# Altium schematic sheet WT2_Sensors.SchDoc
size A4
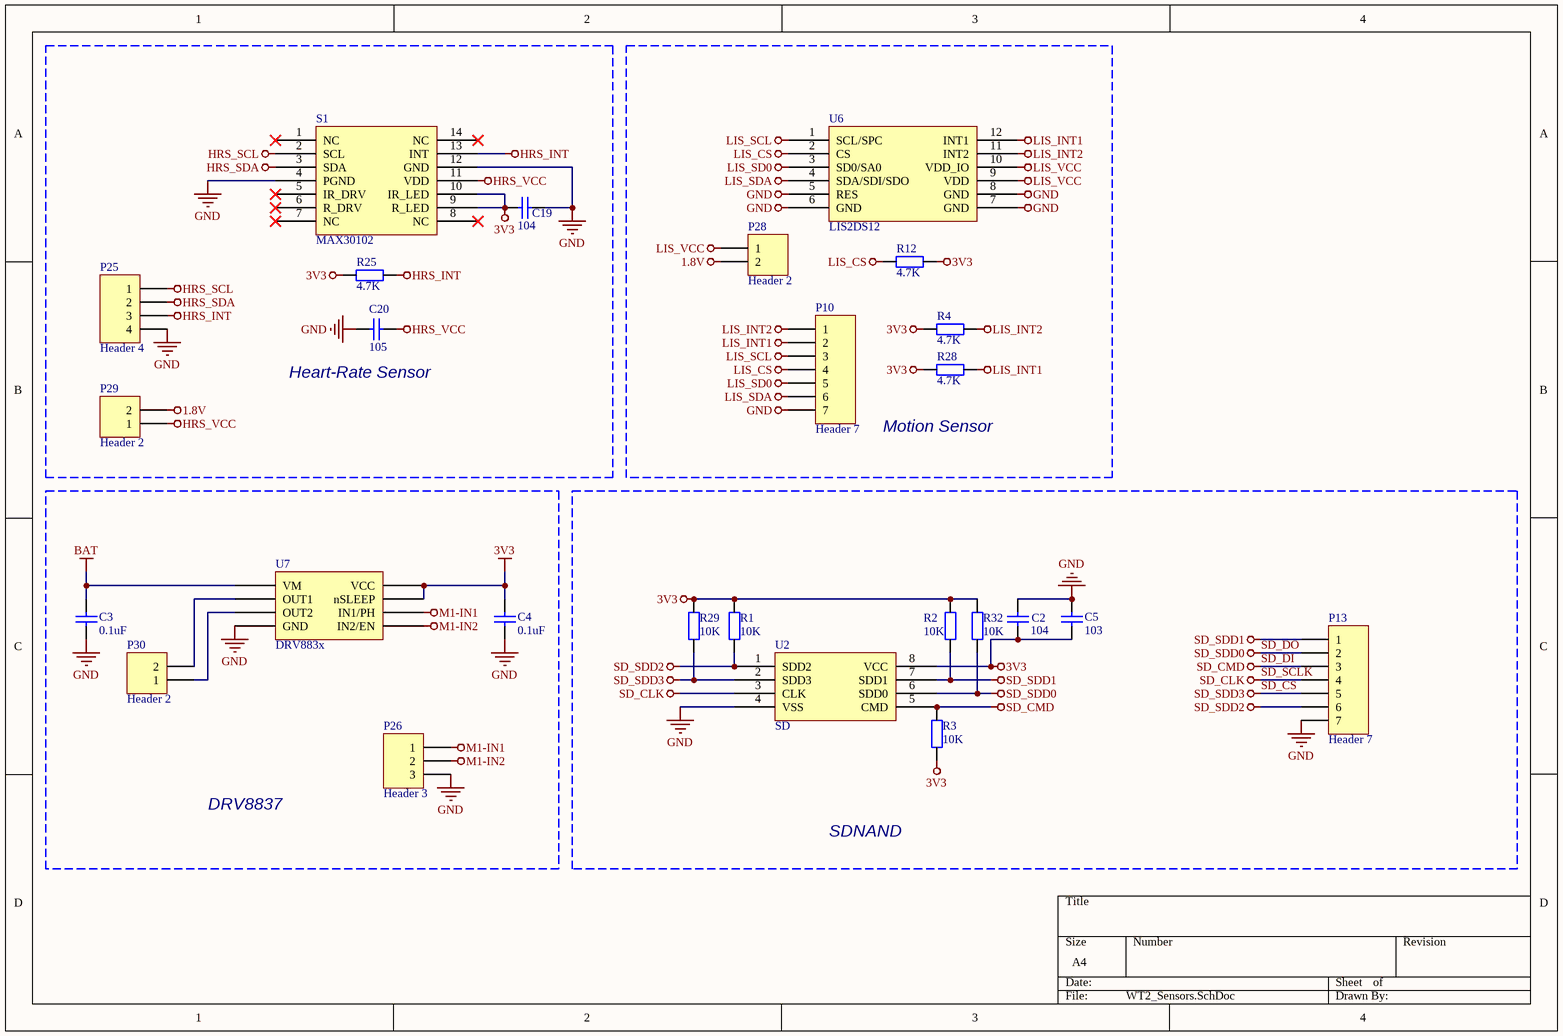
[diagram p0: WT2_Sensors.SchDoc]

## Parts
C2  104  [电容_C0603]
C3  0.1uF  [电容_C0603]
C4  0.1uF  [电容_C0603]
C5  103  [电容_C0603]
C19  104  [电容_C0603]
C20  105  [电容_C0603]
P10  Header 7  [HDR1X7]
P13  Header 7  [HDR1X7]
P25  Header 4  [HDR1X4]
P26  Header 3  [HDR1X3]
P28  Header 2  [HDR1X2]
P29  Header 2  [HDR1X2]
P30  Header 2  [HDR1X2]
R1  10K  [电阻_R0603]
R2  10K  [电阻_R0603]
R3  10K  [电阻_R0603]
R4  4.7K  [电阻_R0603]
R12  4.7K  [电阻_R0603]
R25  4.7K  [电阻_R0603]
R28  4.7K  [电阻_R0603]
R29  10K  [电阻_R0603]
R32  10K  [电阻_R0603]
S1  MAX30102  [MAX30102]
U2  SD  [LGA-8_6*8mm2]
U6  LIS2DS12  [LGA-12_2*2mm]
U7  DRV883x  [WSON-8_2*2]

## Blocks framed on the sheet
Heart-Rate Sensor: C19 C20 P25 P29 R25 S1
Motion Sensor: P10 P28 R4 R12 R28 U6
DRV8837: C3 C4 P26 P30 U7
SDNAND: C2 C5 P13 R1-R3 R29 R32 U2

## Nets
1.8V: P28.2 P29.2
3V3: C2.1 C4.2 C5.1 C19.2 R1.1 R2.1 R3.2 R4.2 R12.1 R25.2 R28.2 R29.1 R32.1 S1.9(R_LED) S1.10(IR_LED) U2.8(VCC) U7.7(nSLEEP) U7.8(VCC)
BAT: C3.1 U7.1(VM)
GND: C2.2 C3.2 C4.1 C5.2 C19.1 C20.2 P10.7 P13.7 P25.4 P26.3 S1.4(PGND) S1.12(GND) U2.4(VSS) U6.5(RES) U6.6(GND) U6.7(GND) U6.8(GND) U7.4(GND)
HRS_INT: P25.3 R25.1 S1.13(INT)
HRS_SCL: P25.1 S1.2(SCL)
HRS_SDA: P25.2 S1.3(SDA)
HRS_VCC: C20.1 P29.1 S1.11(VDD)
LIS_CS: P10.4 R12.2 U6.2(CS)
LIS_INT1: P10.2 R28.1 U6.12(INT1)
LIS_INT2: P10.1 R4.1 U6.11(INT2)
LIS_SCL: P10.3 U6.1(SCL/SPC)
LIS_SD0: P10.5 U6.3(SD0/SA0)
LIS_SDA: P10.6 U6.4(SDA/SDI/SDO)
LIS_VCC: P28.1 U6.9(VDD) U6.10(VDD_IO)
M1-IN1: P26.1 U7.6(IN1/PH)
M1-IN2: P26.2 U7.5(IN2/EN)
SD_CS: P13.5 R29.2 U2.2(SDD3)  [also labelled SD_SDD3]
SD_DI: P13.3 R3.1 U2.5(CMD)  [also labelled SD_CMD]
SD_DO: P13.2 R32.2 U2.6(SDD0)  [also labelled SD_SDD0]
SD_SCLK: P13.4 U2.3(CLK)  [also labelled SD_CLK]
SD_SDD1: P13.1 R2.2 U2.7(SDD1)
SD_SDD2: P13.6 R1.2 U2.1(SDD2)
NetP30_1: P30.1 U7.3(OUT2)
NetP30_2: P30.2 U7.2(OUT1)

Not connected (* = marked no-connect by the designer): S1 1(NC)* 5(IR_DRV)* 6(R_DRV)* 7(NC)* 8(NC)* 14(NC)*

## Library data of the parts
C2-C5 C19 C20 = cap: U: 50V; 参数: Cap,0805,X7R,104K,50V,125C,±10%
  C2 C19: C: 104
  C3 C4: C: 0.1uF
  C5: C: 103
  C20: C: 105
P10 P13 = Header 7: Header, 7-Pin; LatestRevisionDate: 17-Jul-2002; LatestRevisionNote: Re-released for DXP Platform.; Publisher: Altium Limited
P25 = Header 4: Header, 4-Pin; LatestRevisionDate: 17-Jul-2002; LatestRevisionNote: Re-released for DXP Platform.; Publisher: Altium Limited
P26 = Header 3: Header, 3-Pin; LatestRevisionDate: 17-Jul-2002; LatestRevisionNote: Re-released for DXP Platform.; Publisher: Altium Limited
P28-P30 = Header 2: Header, 2-Pin; LatestRevisionDate: 17-Jul-2002; LatestRevisionNote: Re-released for DXP Platform.; Publisher: Altium Limited
R1-R4 R12 R25 R28 R29 R32 = Res: P: 1/8W; 参数: Res,0805,0R,±1%,1/8W,100ppm,155C
  R1-R3 R29 R32: R: 10K
  R4 R12 R25 R28: R: 4.7K
S1 = MAX30102: 血氧浓度传感器
U2 = SDNAND
U6 = LIS2DS12: 运动传感器